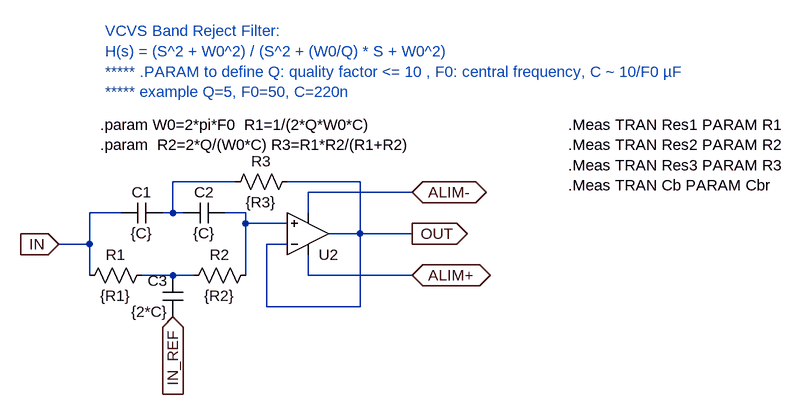
[diagram p0: schematic band-reject-SUB.asc]
band-reject-SUB.asc, the LTspice schematic file:
Version 4
SHEET 1 1232 680
WIRE 272 16 176 16
WIRE 464 16 352 16
WIRE 544 32 384 32
WIRE 96 64 48 64
WIRE 176 64 176 16
WIRE 176 64 160 64
WIRE 192 64 176 64
WIRE 288 64 256 64
WIRE 384 64 384 32
WIRE 288 80 288 64
WIRE 352 80 288 80
WIRE 464 96 464 16
WIRE 464 96 416 96
WIRE 544 96 464 96
WIRE 48 112 48 64
WIRE 48 112 0 112
WIRE 352 112 320 112
WIRE 48 160 48 112
WIRE 176 160 128 160
WIRE 208 160 176 160
WIRE 288 160 288 80
WIRE 384 160 384 128
WIRE 544 160 384 160
WIRE 320 208 320 112
WIRE 464 208 464 96
WIRE 464 208 320 208
FLAG 176 224 IN_REF
IOPIN 176 224 In
FLAG 0 112 IN
IOPIN 0 112 In
FLAG 544 32 ALIM-
IOPIN 544 32 BiDir
FLAG 544 96 OUT
IOPIN 544 96 Out
FLAG 544 160 ALIM+
IOPIN 544 160 BiDir
SYMBOL cap 160 48 R90
WINDOW 0 0 32 VBottom 2
WINDOW 3 32 32 VTop 2
SYMATTR InstName C1
SYMATTR Value {C}
SYMBOL cap 256 48 R90
WINDOW 0 0 32 VBottom 2
WINDOW 3 32 32 VTop 2
SYMATTR InstName C2
SYMATTR Value {C}
SYMBOL cap 192 224 R180
WINDOW 0 24 56 Left 2
WINDOW 3 24 8 Left 2
SYMATTR InstName C3
SYMATTR Value {2*C}
SYMBOL res 144 144 R90
WINDOW 0 0 56 VBottom 2
WINDOW 3 32 56 VTop 2
SYMATTR InstName R1
SYMATTR Value {R1}
SYMBOL res 304 144 R90
WINDOW 0 0 56 VBottom 2
WINDOW 3 32 56 VTop 2
SYMATTR InstName R2
SYMATTR Value {R2}
SYMBOL res 368 0 R90
WINDOW 0 0 56 VBottom 2
WINDOW 3 32 56 VTop 2
SYMATTR InstName R3
SYMATTR Value {R3}
SYMBOL Opamps\\UniversalOpamp2 384 96 M180
SYMATTR InstName U2
SYMATTR Value2 Avol=1Meg GBW=10Meg Slew=100Meg
TEXT 64 -72 Left 2 !.param W0=2*pi*F0  R1=1/(2*Q*W0*C)\n.param  R2=2*Q/(W0*C) R3=R1*R2/(R1+R2)
TEXT 784 -72 Left 2 !.Meas TRAN Res1 PARAM R1\n.Meas TRAN Res2 PARAM R2\n.Meas TRAN Res3 PARAM R3\n.Meas TRAN Cb PARAM Cbr
TEXT 72 -216 Left 2 ;VCVS Band Reject Filter:\nH(s) = (S^2 + W0^2) / (S^2 + (W0/Q) * S + W0^2)\n***** .PARAM to define Q: quality factor <= 10 , F0: central frequency, C ~ 10/F0 µF\n***** example Q=5, F0=50, C=220n

The netlist it stands for:
* band-reject-SUB.asc
C1 N001 IN {C}
C2 N002 N001 {C}
C3 IN_REF N003 {2*C}
R1 N003 IN {R1}
R2 N002 N003 {R2}
R3 OUT N001 {R3}
XU2 N002 OUT ALIM+ ALIM- OUT level.2 Avol=1Meg GBW=10Meg Slew=100Meg ilimit=25m rail=0 Vos=0 phimargin=45 en=0 enk=0 in=0 ink=0 Rin=500Meg  ; pins IN+ IN- V+ V- OUT
.param W0=2*pi*F0  R1=1/(2*Q*W0*C)
.param  R2=2*Q/(W0*C) R3=R1*R2/(R1+R2)
.Meas TRAN Res1 PARAM R1
.Meas TRAN Res2 PARAM R2
.Meas TRAN Res3 PARAM R3
.Meas TRAN Cb PARAM Cbr
* VCVS Band Reject Filter:
* H(s) = (S^2 + W0^2) / (S^2 + (W0/Q) * S + W0^2)
* ***** .PARAM to define Q: quality factor <= 10 , F0: central frequency, C ~ 10/F0 µF
* ***** example Q=5, F0=50, C=220n
.lib UniversalOpamps2.sub
.backanno
.end